# EAGLE schematic main (EAGLE 8.3.2)
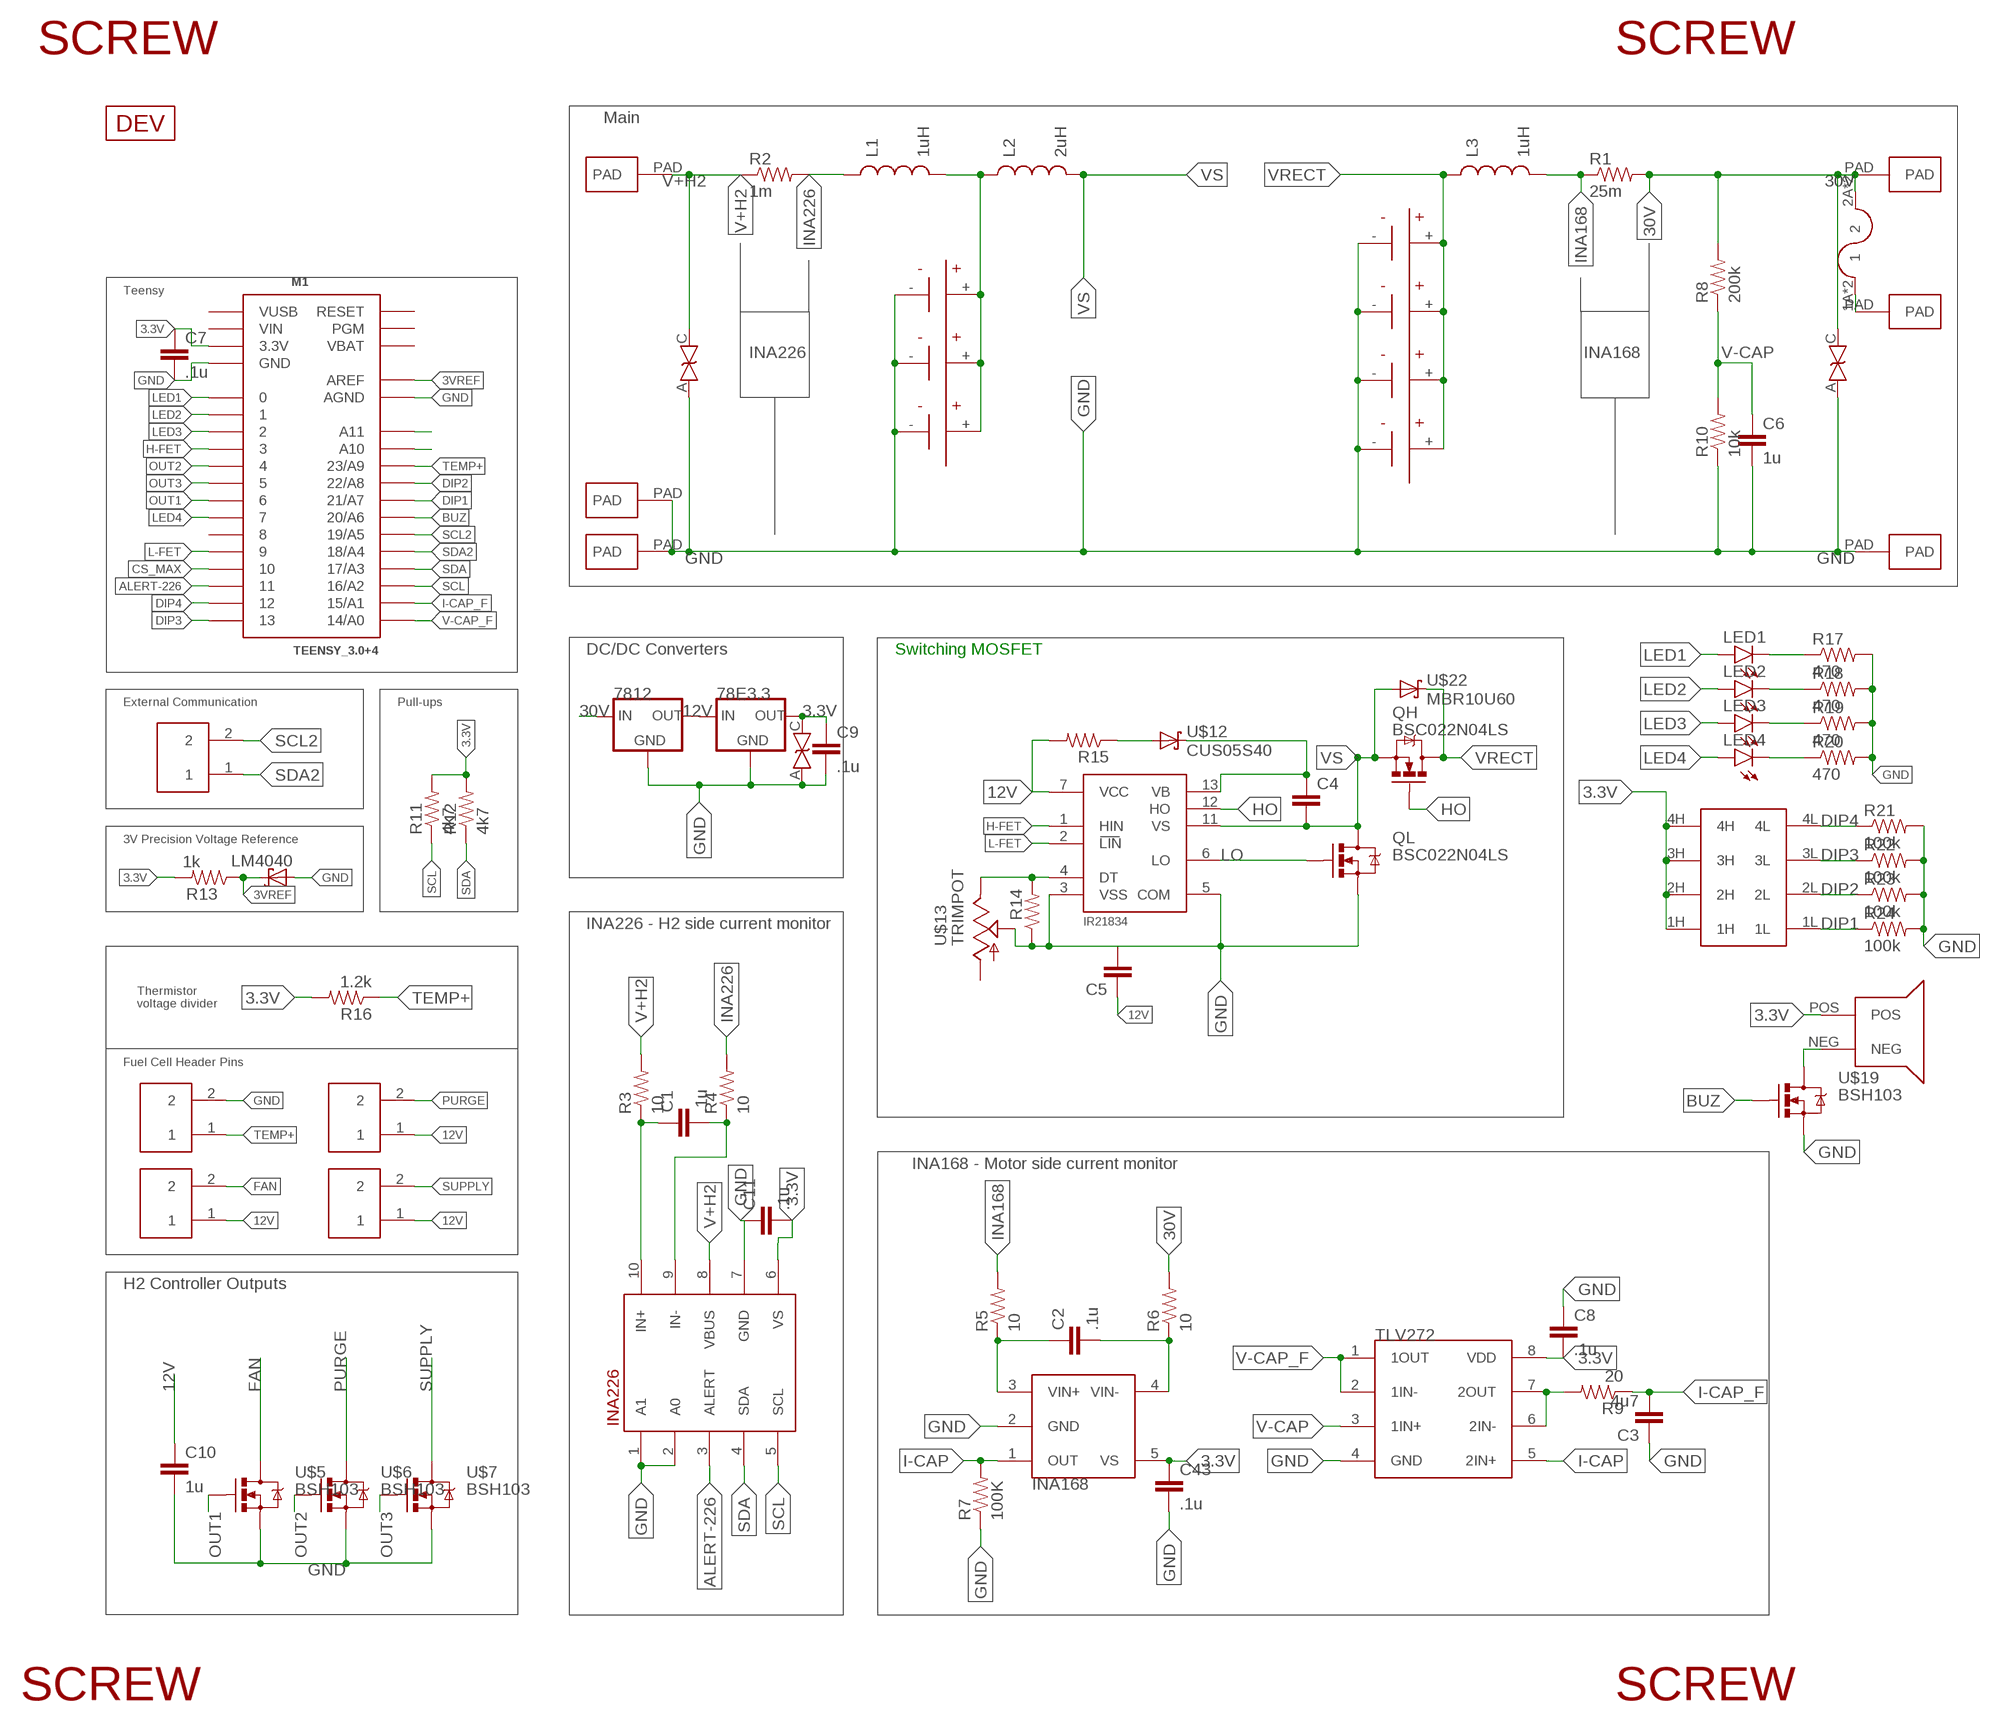
[diagram p0: schematic, sheet 1]

## Parts
78E3.3  V_REG_78XXR-78E  [V78W]
7812  V_REG_78XXV78W  [V78W]
C1  .1u  CAP0603-CAP  [0603-CAP]
C1-1  2400u  CAP-AL_ELECTROLYTIC  [CAP-RADIAL]
C1-2  2400u  CAP-AL_ELECTROLYTIC  [CAP-RADIAL]
C1-3  2400u  CAP-AL_ELECTROLYTIC  [CAP-RADIAL]
C2  .1u  CAP0603-CAP  [0603-CAP]
C2-1  2400u  CAP-AL_ELECTROLYTIC  [CAP-RADIAL]
C2-2  2400u  CAP-AL_ELECTROLYTIC  [CAP-RADIAL]
C2-3  2400u  CAP-AL_ELECTROLYTIC  [CAP-RADIAL]
C2-4  2400u  CAP-AL_ELECTROLYTIC  [CAP-RADIAL]
C3  4u7  CAP0603-CAP  [0603-CAP]
C4  CAP0603-CAP  [0603-CAP]
C5  CAP0603-CAP  [0603-CAP]
C6  1u  CAP0603-CAP  [0603-CAP]
C7  .1u  CAP0603-CAP  [0603-CAP]
C8  .1u  CAP0603-CAP  [0603-CAP]
C9  .1u  CAP0603-CAP  [0603-CAP]
C10  1u  CAP0603-CAP  [0603-CAP]
C11  .1u  CAP0603-CAP  [0603-CAP]
C43  .1u  CAP0603-CAP  [0603-CAP]
FAN  HEADER2  [2PINVALULOK]
H1  HEADER2  [2PINVALULOK]
L1  1uH  INDUCTORSER2010-102  [SER20XX]
L2  2uH  D1787-AL  [D1787]
L3  1uH  INDUCTORSER2010-102  [SER20XX]
LED1  LED0603  [LED-0603]
LED2  LED0603  [LED-0603]
LED3  LED0603  [LED-0603]
LED4  LED0603  [LED-0603]
M1  TEENSY_3.0+4  [TEENSY_3.0+4]
PURGEVALVE  HEADER2  [2PINVALULOK]
QH  BSC022N04LS  [PG-TDSON-8]
QL  BSC022N04LS  [PG-TDSON-8]
R1  25m  RESISTOR2512  [R2512]
R2  1m  RESISTOR2512  [R2512]
R3  10  RESISTOR0603-RES  [0603-RES]
R4  10  RESISTOR0603-RES  [0603-RES]
R5  10  RESISTOR0603-RES  [0603-RES]
R6  10  RESISTOR0603-RES  [0603-RES]
R7  100K  RESISTOR0603-RES  [0603-RES]
R8  200k  RESISTOR0603-RES  [0603-RES]
R9  20  RESISTOR0603-RES  [0603-RES]
R10  10k  RESISTOR0603-RES  [0603-RES]
R11  4k7  RESISTOR0603-RES  [0603-RES]
R12  4k7  RESISTOR0603-RES  [0603-RES]
R13  1k  RESISTOR0603-RES  [0603-RES]
R14  RESISTOR0603-RES  [0603-RES]
R15  RESISTOR0603-RES  [0603-RES]
R16  1.2k  RESISTOR0603-RES  [0603-RES]
R17  470  RESISTOR0603-RES  [0603-RES]
R18  470  RESISTOR0603-RES  [0603-RES]
R19  470  RESISTOR0603-RES  [0603-RES]
R20  470  RESISTOR0603-RES  [0603-RES]
R21  100k  RESISTOR0603-RES  [0603-RES]
R22  100k  RESISTOR0603-RES  [0603-RES]
R23  100k  RESISTOR0603-RES  [0603-RES]
R24  100k  RESISTOR0603-RES  [0603-RES]
SUPPLYVALVE  HEADER2  [2PINVALULOK]
THERMISTOR  HEADER2  [2PINVALULOK]
TVS1  15V  TVSDO-214AB  [DO-214AB]
TVS2  60V  TVSDO-214AB  [DO-214AB]
TVS3  3.3V  TVSSOD-523  [SOD-523]
U1  INA226  [PSOP-10]
U2  INA168INA168  [SOT23-5]
U3  TLV272  [8-VSSOP]
U$1  PAD  [PAD]
U$2  PAD  [PAD]
U$3  PAD  [PAD]
U$4  PAD  [PAD]
U$5  BSH103  [SOT23-3]
U$6  BSH103  [SOT23-3]
U$7  BSH103  [SOT23-3]
U$8  SCREW  [M3HOLE]
U$9  IR21834  [SO14]
U$10  PAD  [PAD]
U$11  SCREW  [M3HOLE]
U$12  CUS05S40  [SOD323_ST]
U$13  TRIMPOT  [3MM_TRIMM]
U$14  LM4040  [SOT23-3]
U$15  FUSE  [AUTO_FUSE]
U$16  PAD  [PAD]
U$17  SCREW  [M3HOLE]
U$18  BUZZER12MM  [BUZZER_12MM]
U$19  BSH103  [SOT23-3]
U$20  DIP_SWITCH  [DIPSWITCH4]
U$21  DEV  [DEV]
U$22  MBR10U60  [TO-277]
U$29  SCREW  [M3HOLE]

## Nets
3.3V: 78E3.3.OUT C7.1 C8.2 C9.1 C11.2 C43.1 M1.3.3V M1.3.3V1(3.3V) R11.2 R12.2 R13.2 R16.2 TVS3.C U1.6(VS) U2.5(VS) U3.8(VDD) U$18.POS U$20.1H U$20.2H U$20.3H U$20.4H
3VREF: M1.AREF R13.1 U$14.1(C)
12V: 78E3.3.IN 7812.OUT C5.1 C10.1 FAN.1 PURGEVALVE.1 R15.2 SUPPLYVALVE.1 U$9.7(VCC)
30V: 7812.IN R1.2 R6.2 R8.2 TVS2.C U$1.PAD U$15.2A U$15.2B
30VFUSED: U$15.1A U$15.1B U$16.PAD
ALERT-226: M1.11 U1.3(ALERT)
BUZ: M1.20/A6 U$19.1(G)
CS_MAX: M1.10
DIP1: M1.21/A7 R24.1 U$20.1L
DIP2: M1.22/A8 R23.1 U$20.2L
DIP3: M1.13 R22.1 U$20.3L
DIP4: M1.12 R21.1 U$20.4L
DT: R14.2 U$9.4(DT) U$13.3(E)
FAN: FAN.2 U$5.3(D)
GND: 78E3.3.GND 7812.GND C1-1.-(V-) C1-2.-(V-) C1-3.-(V-) C2-1.-(V-) C2-2.-(V-) C2-3.-(V-) C2-4.-(V-) C3.1 C5.2 C6.2 C7.2 C8.1 C9.2 C10.2 C11.1 C43.2 M1.AGND M1.GND M1.GND1(GND) QL.1(S) QL.2(S) QL.3(S) R7.1 R10.1 R14.1 R17.2 R18.2 R19.2 R20.2 R21.2 R22.2 R23.2 R24.2 THERMISTOR.2 TVS1.A TVS2.A TVS3.A U1.1(A1) U1.2(A0) U1.7(GND) U2.2(GND) U3.4(GND) U$2.PAD U$4.PAD U$5.2(S) U$6.2(S) U$7.2(S) U$9.3(VSS) U$9.5(COM) U$10.PAD U$13.2(S) U$14.2(A) U$19.2(S)
H-FET: M1.3 U$9.1(HIN)
HO: QH.4(G) U$9.12(HO)
I-CAP: R7.2 U2.1(OUT) U3.5(2IN+)
I-CAP_F: C3.2 M1.15/A1 R9.1
INA168: L3.1 R1.1 R5.2
INA226: L1.2 R2.2 R4.2
L-FET: M1.9 U$9.2(LIN)
LED1: LED1.A M1.0
LED2: LED2.A M1.1
LED3: LED3.A M1.2
LED4: LED4.A M1.7
LO: QL.4(G) U$9.6(LO)
N$1: C1.1 R3.1 U1.10(IN+)
N$2: C2.1 R5.1 U2.3(VIN+)
N$3: C1.2 R4.1 U1.9(IN-)
N$4: C2.2 R6.1 U2.4(VIN-)
N$5: R15.1 U$12.A
N$6: C1-1.+(V+) C1-2.+(V+) C1-3.+(V+) L1.1 L2.P$2
N$7: LED1.C R17.1
N$8: LED2.C R18.1
N$9: R9.2 U3.6(2IN-) U3.7(2OUT)
N$10: LED3.C R19.1
N$13: LED4.C R20.1
N$16: U$18.NEG U$19.3(D)
N$18: M1.A10
N$19: M1.A11
OUT1: M1.6 U$5.1(G)
OUT2: M1.4 U$6.1(G)
OUT3: M1.5 U$7.1(G)
PURGE: PURGEVALVE.2 U$6.3(D)
SCL: M1.16/A2 R11.1 U1.5(SCL)
SCL2: H1.2 M1.19/A5
SDA: M1.17/A3 R12.1 U1.4(SDA)
SDA2: H1.1 M1.18/A4
SUPPLY: SUPPLYVALVE.2 U$7.3(D)
TEMP+: M1.23/A9 R16.1 THERMISTOR.1
V+H2: R2.1 R3.2 TVS1.C U1.8(VBUS) U$3.PAD
V-CAP: C6.1 R8.1 R10.2 U3.3(1IN+)
V-CAP_F: M1.14/A0 U3.1(1OUT) U3.2(1IN-)
VB: C4.1 U$9.13(VB) U$12.C
VRECT: C2-1.+(V+) C2-2.+(V+) C2-3.+(V+) C2-4.+(V+) L3.2 QH.5(D) QH.6(D) QH.7(D) QH.8(D) QH.TH(D) U$22.3(C)
VS: C4.2 L2.P$1 QH.1(S) QH.2(S) QH.3(S) QL.5(D) QL.6(D) QL.7(D) QL.8(D) QL.TH(D) U$9.11(VS) U$22.1(A) U$22.2(A)
Unconnected: M1.8 M1.PGM M1.RESET U$13.1(A)

## Notes on the sheet
- Main
- Teensy
- INA226 | INA168
- DC/DC Converters | Switching MOSFET
- External Communication | Pull-ups
- 3V Precision Voltage Reference
- INA226 - H2 side current monitor
- Thermistor
  voltage divider
- Fuel Cell Header Pins
- INA168 - Motor side current monitor
- H2 Controller Outputs

## Power pins joined to a net without a drawn wire
VBAT: M1.VBAT
VIN: M1.VIN
VUSB: M1.VUSB

## Library data of the parts
78E3.3 7812 = 2018:V_REG_78XX: Voltage Regulator Standard 7805 5V regulator. IGO (Input Ground Output). Spark Fun Electronics SKU : COM-00107
C1-C11 C43 = SparkFun-Passives:CAP: Capacitor Standard 0603 ceramic capacitor, and 0.1" leaded capacitor.
C1-1-C1-3 C2-1-C2-4 = 2018:CAP-AL_ELECTROLYTIC
FAN H1 PURGEVALVE SUPPLYVALVE THERMISTOR = Custom_old:HEADER2
L1 L3 = 2018:INDUCTOR
L2 = 2018:D1787-AL
LED1-LED4 = SparkFun-LED:LED: LEDs Standard schematic elements and footprints for 5mm, 3mm, 1206, and 0603 sized LEDs. 5mm - Spark Fun Electronics SKU : COM-00529 (and others)
M1 = Teensy3.0:TEENSY_3.0+4: Teensy 3.0 board, showing all pins that are easily acessible. See 'AllAnalogPins" and 'AllPins' packages for additional pin holes, as needed. The 'Basic' package has fewer pins.
QH QL = 2018:BSC022N04LS
R1-R24 = SparkFun-Passives:RESISTOR: Resistor Basic schematic elements and footprints for 0603, 1206, and PTH resistors.
TVS1-TVS3 = 2018:TVS
U1 = 2018:INA226
U2 = 2018:INA168
U3 = 2018:TLV272
U$1-U$4 U$10 U$16 = Custom_old:PAD
U$5-U$7 U$19 = 2018:BSH103
U$8 U$11 U$17 U$29 = Custom_old:SCREW
U$9 = 2018:IR21834
U$12 = 2018:CUS05S40
U$13 = 2018:TRIMPOT
U$14 = 2018:LM4040
U$15 = Custom_old:FUSE
U$18 = 2018:BUZZER
U$20 = Custom_old:DIP_SWITCH
U$21 = Custom_old:DEV
U$22 = 2018:MBR10U60